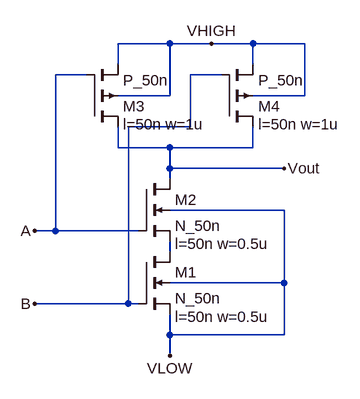
[diagram p0: schematic NAND.asc]
NAND.asc, the LTspice schematic file:
Version 4
SHEET 1 880 680
WIRE 224 -128 144 -128
WIRE 288 -128 224 -128
WIRE 352 -128 288 -128
WIRE 432 -128 352 -128
WIRE 144 -96 144 -128
WIRE 352 -96 352 -128
WIRE 96 -80 48 -80
WIRE 304 -80 256 -80
WIRE 224 -48 224 -128
WIRE 224 -48 144 -48
WIRE 432 -48 432 -128
WIRE 432 -48 352 -48
WIRE 256 0 256 -80
WIRE 256 0 160 0
WIRE 144 32 144 0
WIRE 224 32 144 32
WIRE 352 32 352 0
WIRE 352 32 224 32
WIRE 224 64 224 32
WIRE 400 64 224 64
WIRE 224 80 224 64
WIRE 400 128 224 128
WIRE 48 160 48 -80
WIRE 48 160 16 160
WIRE 176 160 48 160
WIRE 224 192 224 176
WIRE 400 240 400 128
WIRE 400 240 224 240
WIRE 160 272 160 0
WIRE 160 272 16 272
WIRE 176 272 160 272
WIRE 224 320 224 288
WIRE 400 320 400 240
WIRE 400 320 224 320
WIRE 224 352 224 320
FLAG 16 160 A
FLAG 16 272 B
FLAG 224 352 VLOW
FLAG 400 64 Vout
FLAG 288 -128 VHIGH
SYMBOL nmos4 176 192 R0
WINDOW 123 56 100 Left 2
SYMATTR Value2 l=50n w=0.5u
SYMATTR InstName M1
SYMATTR Value N_50n
SYMBOL nmos4 176 80 R0
WINDOW 123 56 100 Left 2
SYMATTR Value2 l=50n w=0.5u
SYMATTR InstName M2
SYMATTR Value N_50n
SYMBOL pmos4 304 0 M180
WINDOW 123 56 4 Left 2
SYMATTR Value2 l=50n w=1u
SYMATTR InstName M4
SYMATTR Value P_50n
SYMBOL pmos4 96 0 M180
WINDOW 123 56 4 Left 2
SYMATTR Value2 l=50n w=1u
SYMATTR InstName M3
SYMATTR Value P_50n

The netlist it stands for:
* NAND.asc
M1 N001 B VLOW VLOW N_50n l=50n w=0.5u
M2 Vout A N001 VLOW N_50n l=50n w=0.5u
M4 Vout B VHIGH VHIGH P_50n l=50n w=1u
M3 Vout A VHIGH VHIGH P_50n l=50n w=1u
.model NMOS NMOS
.model PMOS PMOS
.lib standard.mos
.backanno
.end